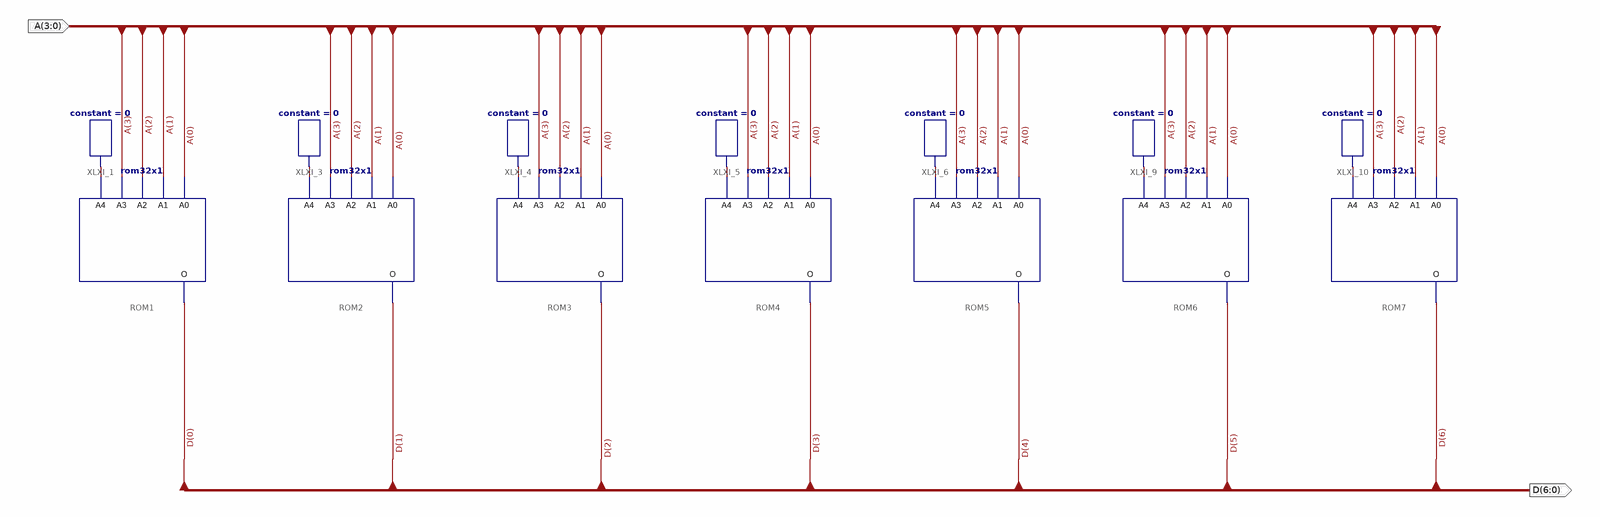
[diagram p0: schematic sheet 1]
// Xilinx ISE schematic Rom16x7.sch (virtex6) as structural Verilog: 14 symbols, 2 ports
module Rom16x7 (
  input  [3:0] A,
  output [6:0] D
);

  wire XLXN_1, XLXN_3, XLXN_4, XLXN_5, XLXN_6, XLXN_8, XLXN_9;

  rom32x1 #(.INIT("00000068"), .Device("ROM1")) ROM1 (
    .A0(A[0]), .A1(A[1]), .A2(A[2]), .A3(A[3]), .A4(XLXN_1), .O(D[0]));
  rom32x1 #(.INIT("00000000"), .Device("ROM2")) ROM2 (
    .A0(A[0]), .A1(A[1]), .A2(A[2]), .A3(A[3]), .A4(XLXN_3), .O(D[1]));
  rom32x1 #(.INIT("00000008"), .Device("ROM3")) ROM3 (
    .A0(A[0]), .A1(A[1]), .A2(A[2]), .A3(A[3]), .A4(XLXN_4), .O(D[2]));
  rom32x1 #(.INIT("00000049"), .Device("ROM4")) ROM4 (
    .A0(A[0]), .A1(A[1]), .A2(A[2]), .A3(A[3]), .A4(XLXN_5), .O(D[3]));
  rom32x1 #(.INIT("000002FA"), .Device("ROM5")) ROM5 (
    .A0(A[0]), .A1(A[1]), .A2(A[2]), .A3(A[3]), .A4(XLXN_6), .O(D[4]));
  rom32x1 #(.INIT("00000146"), .Device("ROM6")) ROM6 (
    .A0(A[0]), .A1(A[1]), .A2(A[2]), .A3(A[3]), .A4(XLXN_8), .O(D[5]));
  rom32x1 #(.INIT("000007D4"), .Device("ROM7")) ROM7 (
    .A0(A[0]), .A1(A[1]), .A2(A[2]), .A3(A[3]), .A4(XLXN_9), .O(D[6]));
  constant #(.CValue("0")) XLXI_1 (.O(XLXN_1));
  constant #(.CValue("0")) XLXI_3 (.O(XLXN_3));
  constant #(.CValue("0")) XLXI_4 (.O(XLXN_4));
  constant #(.CValue("0")) XLXI_5 (.O(XLXN_5));
  constant #(.CValue("0")) XLXI_6 (.O(XLXN_6));
  constant #(.CValue("0")) XLXI_9 (.O(XLXN_8));
  constant #(.CValue("0")) XLXI_10 (.O(XLXN_9));
endmodule
